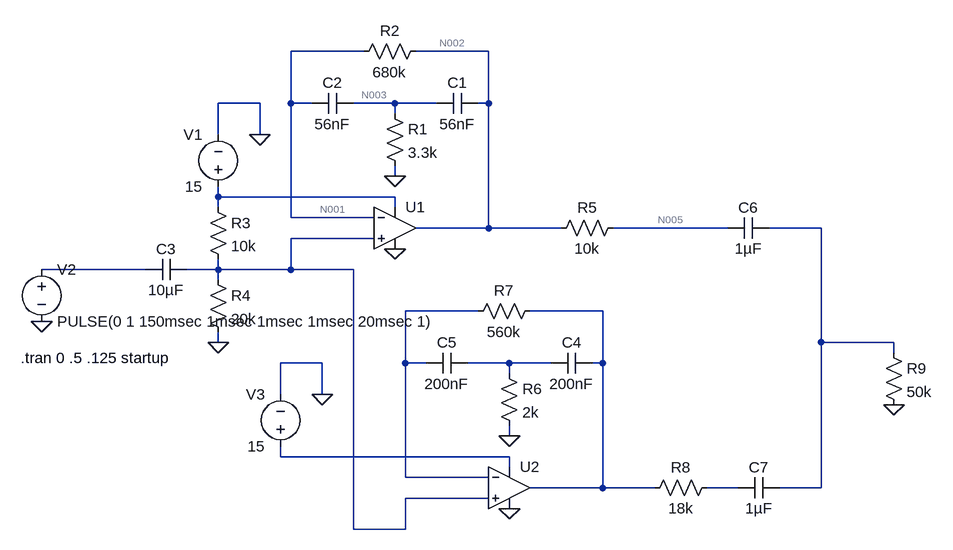
[diagram p0: schematic Draft2.asc]
Draft2.asc, the LTspice schematic file:
Version 4
SHEET 1 1060 680
WIRE 192 -64 80 -64
WIRE 384 -64 272 -64
WIRE 32 16 -32 16
WIRE 80 16 80 -64
WIRE 112 16 80 16
WIRE 240 16 176 16
WIRE 304 16 240 16
WIRE 384 16 384 -64
WIRE 384 16 368 16
WIRE 240 32 240 16
WIRE -32 64 -32 16
WIRE 32 64 32 16
WIRE 240 128 240 112
WIRE -32 160 -32 144
WIRE 240 160 -32 160
WIRE -32 176 -32 160
WIRE 240 176 240 160
WIRE 80 192 80 16
WIRE 208 192 80 192
WIRE 384 208 384 16
WIRE 384 208 272 208
WIRE 496 208 384 208
WIRE 752 208 576 208
WIRE 896 208 816 208
WIRE 208 224 80 224
WIRE -144 272 -304 272
WIRE -32 272 -32 256
WIRE -32 272 -80 272
WIRE 80 272 80 224
WIRE 80 272 -32 272
WIRE 176 272 80 272
WIRE -32 288 -32 272
WIRE 368 336 256 336
WIRE 560 336 448 336
WIRE -32 384 -32 368
WIRE 896 384 896 208
WIRE 1008 384 896 384
WIRE 1008 400 1008 384
WIRE 128 416 64 416
WIRE 256 416 256 336
WIRE 288 416 256 416
WIRE 416 416 352 416
WIRE 480 416 416 416
WIRE 560 416 560 336
WIRE 560 416 544 416
WIRE 416 432 416 416
WIRE 64 464 64 416
WIRE 128 464 128 416
WIRE 416 528 416 512
WIRE 64 560 64 544
WIRE 416 560 64 560
WIRE 416 576 416 560
WIRE 256 592 256 416
WIRE 384 592 256 592
WIRE 560 608 560 416
WIRE 560 608 448 608
WIRE 640 608 560 608
WIRE 768 608 720 608
WIRE 896 608 896 384
WIRE 896 608 832 608
WIRE 384 624 256 624
WIRE 176 672 176 272
WIRE 256 672 256 624
WIRE 256 672 176 672
FLAG 240 128 0
FLAG 32 64 0
FLAG -32 384 0
FLAG -304 352 0
FLAG 240 240 0
FLAG 416 528 0
FLAG 416 640 0
FLAG 1008 480 0
FLAG 128 464 0
SYMBOL res 224 16 R0
SYMATTR InstName R1
SYMATTR Value 3.3k
SYMBOL res 288 -80 R90
WINDOW 0 0 56 VBottom 2
WINDOW 3 32 56 VTop 2
SYMATTR InstName R2
SYMATTR Value 680k
SYMBOL cap 368 0 R90
WINDOW 0 0 32 VBottom 2
WINDOW 3 32 32 VTop 2
SYMATTR InstName C1
SYMATTR Value 56nF
SYMBOL cap 176 0 R90
WINDOW 0 0 32 VBottom 2
WINDOW 3 32 32 VTop 2
SYMATTR InstName C2
SYMATTR Value 56nF
SYMBOL voltage -32 160 R180
WINDOW 0 24 96 Left 2
WINDOW 3 24 16 Left 2
WINDOW 123 0 0 Left 0
WINDOW 39 0 0 Left 0
SYMATTR InstName V1
SYMATTR Value 15
SYMBOL res -48 160 R0
SYMATTR InstName R3
SYMATTR Value 10k
SYMBOL res -48 272 R0
SYMATTR InstName R4
SYMATTR Value 20k
SYMBOL cap -80 256 R90
WINDOW 0 0 32 VBottom 2
WINDOW 3 32 32 VTop 2
SYMATTR InstName C3
SYMATTR Value 10µF
SYMBOL voltage -304 256 R0
WINDOW 123 0 0 Left 0
WINDOW 39 0 0 Left 0
SYMATTR InstName V2
SYMATTR Value PULSE(0 1 150msec 1msec 1msec 1msec 20msec 1)
SYMBOL OpAmps\\UniversalOpamp2 240 208 R0
SYMATTR InstName U1
SYMBOL res 592 192 R90
WINDOW 0 0 56 VBottom 2
WINDOW 3 32 56 VTop 2
SYMATTR InstName R5
SYMATTR Value 10k
SYMBOL res 400 416 R0
SYMATTR InstName R6
SYMATTR Value 2k
SYMBOL res 464 320 R90
WINDOW 0 0 56 VBottom 2
WINDOW 3 32 56 VTop 2
SYMATTR InstName R7
SYMATTR Value 560k
SYMBOL cap 544 400 R90
WINDOW 0 0 32 VBottom 2
WINDOW 3 32 32 VTop 2
SYMATTR InstName C4
SYMATTR Value 200nF
SYMBOL cap 352 400 R90
WINDOW 0 0 32 VBottom 2
WINDOW 3 32 32 VTop 2
SYMATTR InstName C5
SYMATTR Value 200nF
SYMBOL OpAmps\\UniversalOpamp2 416 608 R0
SYMATTR InstName U2
SYMBOL res 736 592 R90
WINDOW 0 0 56 VBottom 2
WINDOW 3 32 56 VTop 2
SYMATTR InstName R8
SYMATTR Value 18k
SYMBOL cap 816 192 R90
WINDOW 0 0 32 VBottom 2
WINDOW 3 32 32 VTop 2
SYMATTR InstName C6
SYMATTR Value 1µF
SYMBOL cap 832 592 R90
WINDOW 0 0 32 VBottom 2
WINDOW 3 32 32 VTop 2
SYMATTR InstName C7
SYMATTR Value 1µF
SYMBOL res 992 384 R0
SYMATTR InstName R9
SYMATTR Value 50k
SYMBOL voltage 64 560 R180
WINDOW 0 24 96 Left 2
WINDOW 3 24 16 Left 2
WINDOW 123 0 0 Left 0
WINDOW 39 0 0 Left 0
SYMATTR InstName V3
SYMATTR Value 15
TEXT -336 408 Left 2 !.tran 0 .5 .125 startup

The netlist it stands for:
* Draft2.asc
R1 N003 0 3.3k
R2 N002 N001 680k
C1 N002 N003 56nF
C2 N003 N001 56nF
V1 N004 0 15
R3 N004 N007 10k
R4 N007 0 20k
C3 N007 N008 10µF
V2 N008 0 PULSE(0 1 150msec 1msec 1msec 1msec 20msec 1)
XU1 N007 N001 N004 0 N002 level.2 Avol=1Meg GBW=10Meg Slew=10Meg ilimit=25m rail=0 Vos=0 phimargin=45 en=0 enk=0 in=0 ink=0 Rin=500Meg  ; pins IN+ IN- V+ V- OUT
R5 N005 N002 10k
R6 N011 0 2k
R7 N010 N009 560k
C4 N010 N011 200nF
C5 N011 N009 200nF
XU2 N007 N009 N012 0 N010 level.2 Avol=1Meg GBW=10Meg Slew=10Meg ilimit=25m rail=0 Vos=0 phimargin=45 en=0 enk=0 in=0 ink=0 Rin=500Meg  ; pins IN+ IN- V+ V- OUT
R8 N013 N010 18k
C6 N006 N005 1µF
C7 N006 N013 1µF
R9 N006 0 50k
V3 N012 0 15
.tran 0 .5 .125 startup
.lib UniversalOpamps2.sub
.backanno
.end

* Results of the author's LTspice run, read from the files saved beside the schematic
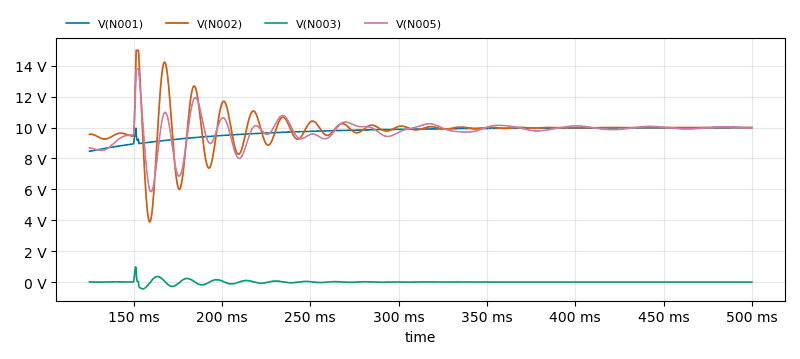
[diagram p1: Transient Analysis of Draft2.asc, plotted from the saved traces]
* Transient Analysis, 1 run:
*   V(N001): min 8.466 V, max 9.994 V, average 9.727 V, rms 9.734 V, last 9.994 V
*   V(N002): min 3.888 V, max 15 V, average 9.887 V, rms 9.95 V, last 10 V
*   V(N003): min -438.1 mV, max 972.3 mV, average 1.036 mV, rms 90.01 mV, last 73.14 µV
*   V(N005): min 5.846 V, max 13.82 V, average 9.778 V, rms 9.812 V, last 9.955 V